# Altium schematic sheet 505153_2_1.SchDoc
size Letter; CheckedBy: BC; DrawnBy: BC; Organization: space-eight.com; Address1: 343 NW 84th St; Address2: Seattle, WA; Address3: 98117; Address4: USA; DocumentNumber: 505XXX; Revision: 1; phone: (323) 791-6991; SP: SP11XXXX; Description: CIRCUIT BOARD; Revdate: --
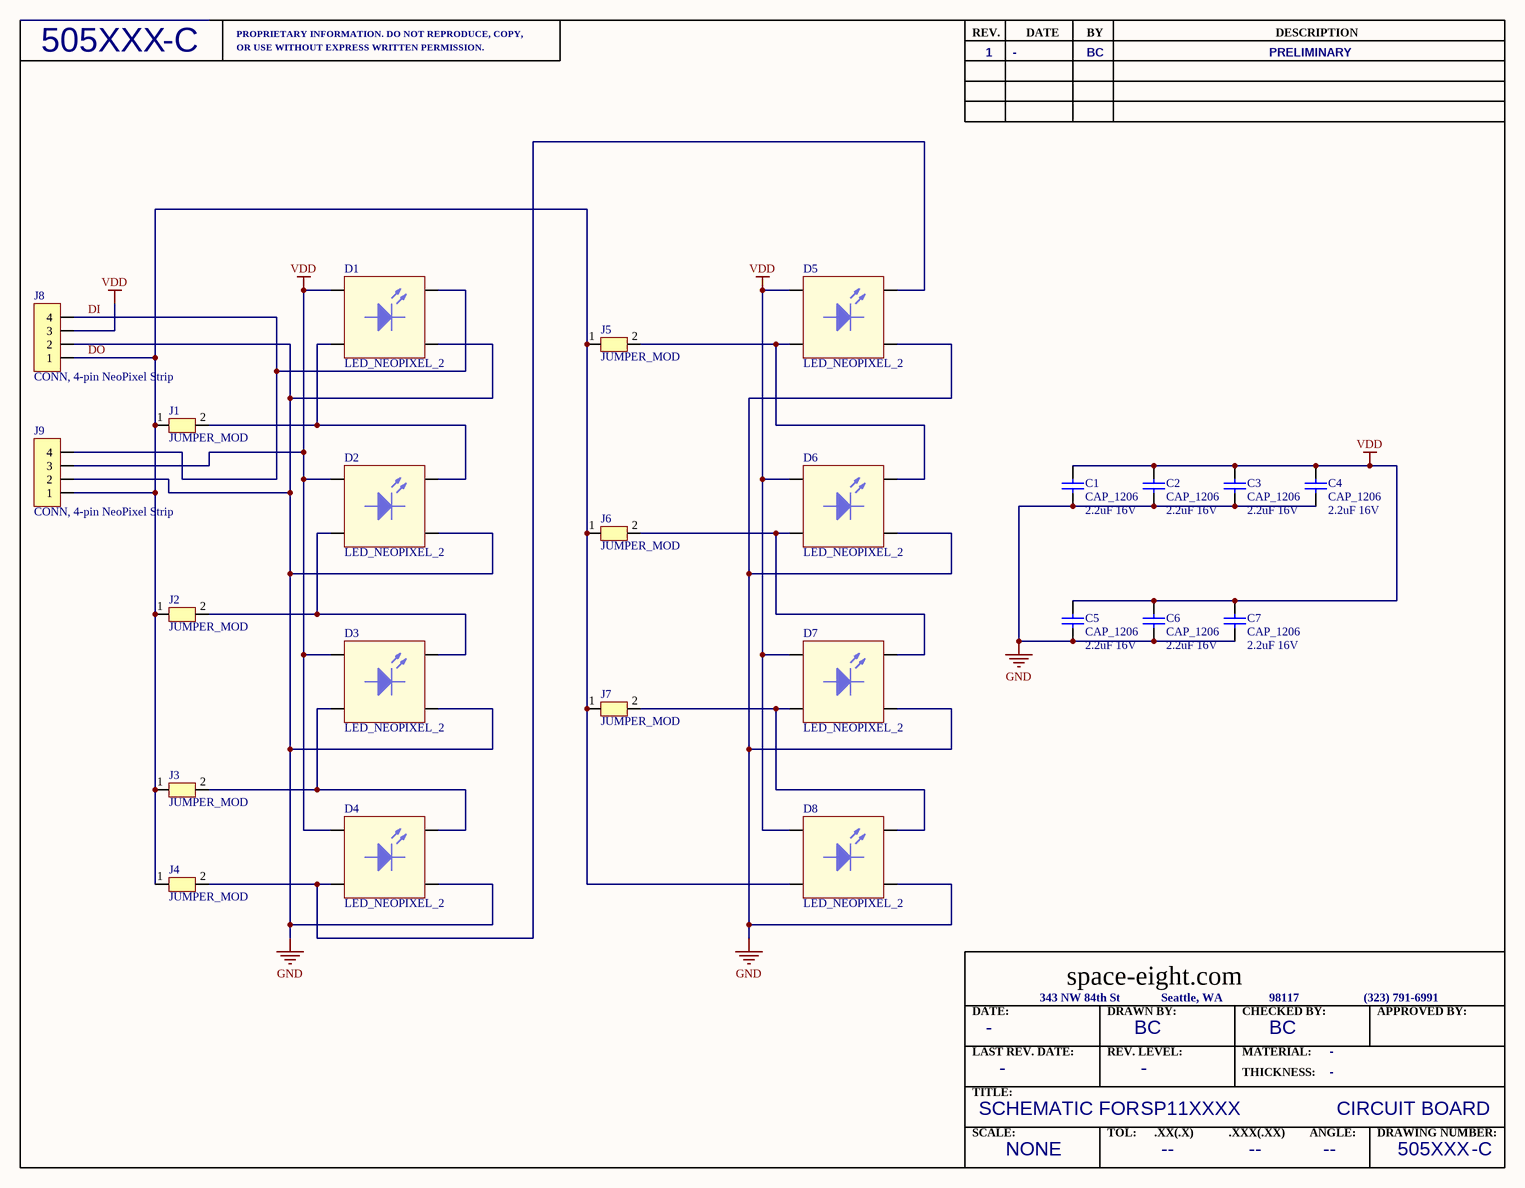
[diagram p0: 505153_2_1.SchDoc]

## Parts
C1  CAP_1206  value 2.2uF 16V  [SMT_1206_MOD]
C2  CAP_1206  value 2.2uF 16V  [SMT_1206_MOD]
C3  CAP_1206  value 2.2uF 16V  [SMT_1206_MOD]
C4  CAP_1206  value 2.2uF 16V  [SMT_1206_MOD]
C5  CAP_1206  value 2.2uF 16V  [SMT_1206_MOD]
C6  CAP_1206  value 2.2uF 16V  [SMT_1206_MOD]
C7  CAP_1206  value 2.2uF 16V  [SMT_1206_MOD]
D1  LED_NEOPIXEL_2  [NEOPIXEL_2]
D2  LED_NEOPIXEL_2  [NEOPIXEL_2]
D3  LED_NEOPIXEL_2  [NEOPIXEL_2]
D4  LED_NEOPIXEL_2  [NEOPIXEL_2]
D5  LED_NEOPIXEL_2  [NEOPIXEL_2]
D6  LED_NEOPIXEL_2  [NEOPIXEL_2]
D7  LED_NEOPIXEL_2  [NEOPIXEL_2]
D8  LED_NEOPIXEL_2  [NEOPIXEL_2]
J1  JUMPER_MOD  [JUMPER_SMT]
J2  JUMPER_MOD  [JUMPER_SMT]
J3  JUMPER_MOD  [JUMPER_SMT]
J4  JUMPER_MOD  [JUMPER_SMT]
J5  JUMPER_MOD  [JUMPER_SMT]
J6  JUMPER_MOD  [JUMPER_SMT]
J7  JUMPER_MOD  [JUMPER_SMT]
J8  CONN, 4-pin NeoPixel Strip  [CONN_NEOPIXEL_1]
J9  CONN, 4-pin NeoPixel Strip  [CONN_NEOPIXEL_1]

## Nets
GND: C1.1 C2.1 C3.1 C4.1 C5.1 C6.1 C7.1 D1.1(GND) D2.1(GND) D3.1(GND) D4.1(GND) D5.1(GND) D6.1(GND) D7.1(GND) D8.1(GND) J8.2 J9.2
VDD: C1.2 C2.2 C3.2 C4.2 C5.2 C6.2 C7.2 D1.3(VDD) D2.3(VDD) D3.3(VDD) D4.3(VDD) D5.3(VDD) D6.3(VDD) D7.3(VDD) D8.3(VDD) J8.3 J9.3
DI: D1.2(DI) J8.4 J9.4
DO: D8.4(DO) J1.1(I/) J2.1(I/) J3.1(I/) J4.1(I/) J5.1(I/) J6.1(I/) J7.1(I/) J8.1 J9.1
NetD1_4: D1.4(DO) D2.2(DI) J1.2(O)
NetD2_4: D2.4(DO) D3.2(DI) J2.2(O)
NetD3_4: D3.4(DO) D4.2(DI) J3.2(O)
NetD4_4: D4.4(DO) D5.2(DI) J4.2(O)
NetD5_4: D5.4(DO) D6.2(DI) J5.2(O)
NetD6_4: D6.4(DO) D7.2(DI) J6.2(O)
NetD7_4: D7.4(DO) D8.2(DI) J7.2(O)

## Notes on the sheet
- PROPRIETARY INFORMATION. DO NOT REPRODUCE, COPY,
- REV.
- DATE
- BY
- DESCRIPTION
- -C
- OR USE WITHOUT EXPRESS WRITTEN PERMISSION.
- 1
- -
- BC
- PRELIMINARY
- LAST REV. DATE:
- DATE:
- REV. LEVEL:
- DRAWN BY:
- MATERIAL:
- CHECKED BY:
- APPROVED BY:
- TITLE:
- SCHEMATIC FOR
- THICKNESS:
- SCALE:
- NONE
- TOL:
- .XX(.X)
- --
- .XXX(.XX)
- ANGLE:
- DRAWING NUMBER:

## Library data of the parts
C1-C7 = CAP_1206: CAP; Manufacturer: Generic Components; Class I: Passive; Class II: Capacitor; Published: 8-Jun-2000; Revision: July-2002: Re-released for DXP Platform.; Publisher: Altium Limited
D1-D8 = LED_NEOPIXEL_2: RGB NEOPIXEL; Manufacturer: Generic Components; Class I: Optoelectronic; Class II: LED; Published: 8-Jun-2000; Revision: July-2002: Re-released for DXP Platform.; Publisher: Altium Limited
J8 J9 = CONN, 4-pin NeoPixel Strip: Conn Neopixel Strip; Revision: 17-Jul-2002: Re-released for DXP Platform.; Publisher: Altium Limited